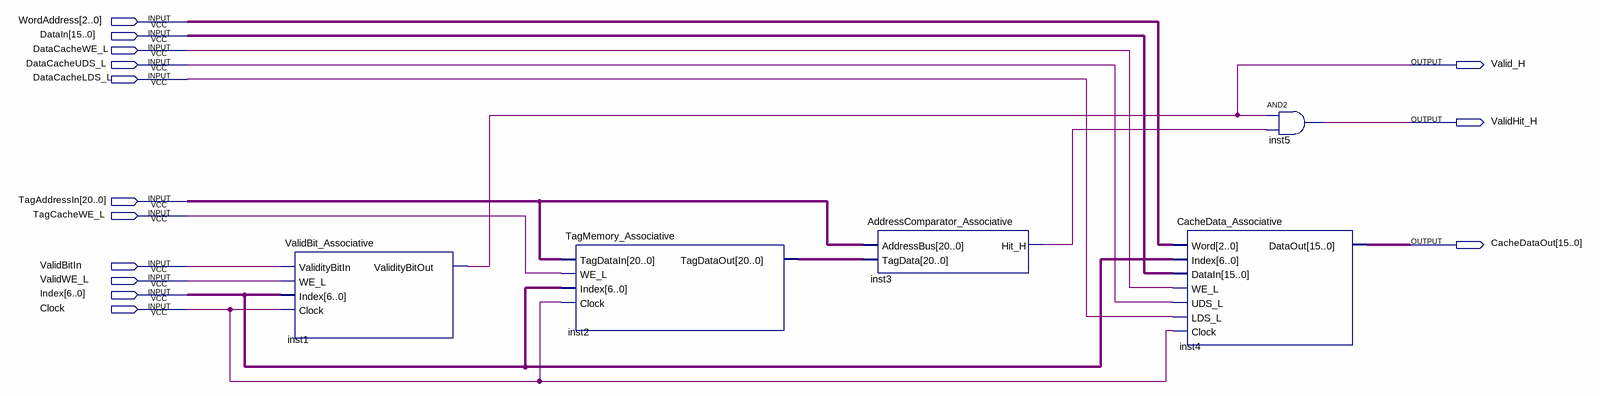
[diagram p0: schematic sheet]
// Quartus schematic AssociativeCache_Set.bdf as structural Verilog: 5 symbols, 14 pins
module AssociativeCache_Set (
  input  [2:0] WordAddress,
  input  [15:0] DataIn,
  input  DataCacheWE_L,
  input  DataCacheUDS_L,
  input  DataCacheLDS_L,
  input  [20:0] TagAddressIn,
  input  TagCacheWE_L,
  input  ValidBitIn,
  input  ValidWE_L,
  input  [6:0] Index,
  input  Clock,
  output Valid_H,
  output ValidHit_H,
  output [15:0] CacheDataOut
);

  wire inst3_hit_h;
  wire [20:0] inst2_tagdataout;

  ValidBit_Associative inst1 (
    .ValidityBitIn(ValidBitIn), .WE_L(ValidWE_L), .Index(Index), .Clock(Clock), .ValidityBitOut(Valid_H));
  TagMemory_Associative inst2 (
    .TagDataIn(TagAddressIn), .WE_L(TagCacheWE_L), .Index(Index), .Clock(Clock), .TagDataOut(inst2_tagdataout));
  AddressComparator_Associative inst3 (.AddressBus(TagAddressIn), .TagData(inst2_tagdataout), .Hit_H(inst3_hit_h));
  CacheData_Associative inst4 (
    .Word(WordAddress), .Index(Index), .DataIn(DataIn), .WE_L(DataCacheWE_L), .UDS_L(DataCacheUDS_L),
    .LDS_L(DataCacheLDS_L), .Clock(Clock), .DataOut(CacheDataOut));
  and inst5 (ValidHit_H, Valid_H, inst3_hit_h);
endmodule
